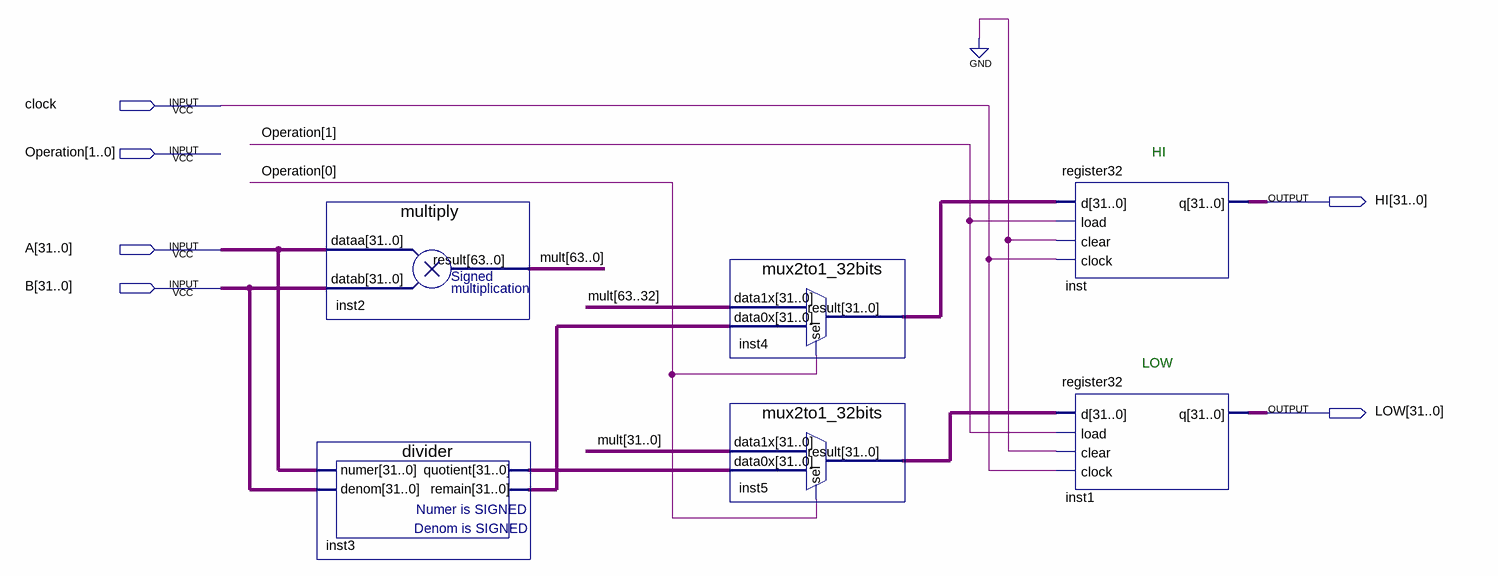
[diagram p0: schematic sheet]
// Quartus schematic Coproc.bdf as structural Verilog: 6 symbols, 6 pins
module Coproc (
  input  clock,
  input  [1:0] Operation,
  input  [31:0] A,
  input  [31:0] B,
  output [31:0] HI,
  output [31:0] LOW
);

  wire [31:0] inst3_quotient, inst3_remain, inst4_result, inst5_result;
  wire [63:0] mult;

  multiply inst2 (.dataa(A), .datab(B), .result(mult));
  divider inst3 (.numer(A), .denom(B), .quotient(inst3_quotient), .remain(inst3_remain));
  mux2to1_32bits inst4 (.data1x(mult[63:32]), .data0x(inst3_remain), .sel(Operation[0]), .result(inst4_result));
  mux2to1_32bits inst5 (.data1x(mult[31:0]), .data0x(inst3_quotient), .sel(Operation[0]), .result(inst5_result));
  register32 inst (.d(inst4_result), .load(Operation[1]), .clear(1'b0), .clock(clock), .q(HI));
  register32 inst1 (.d(inst5_result), .load(Operation[1]), .clear(1'b0), .clock(clock), .q(LOW));

  // Notes on the sheet:
  //   HI
  //   LOW
endmodule
